# Altium schematic sheet Sheet.SchDoc
size A4
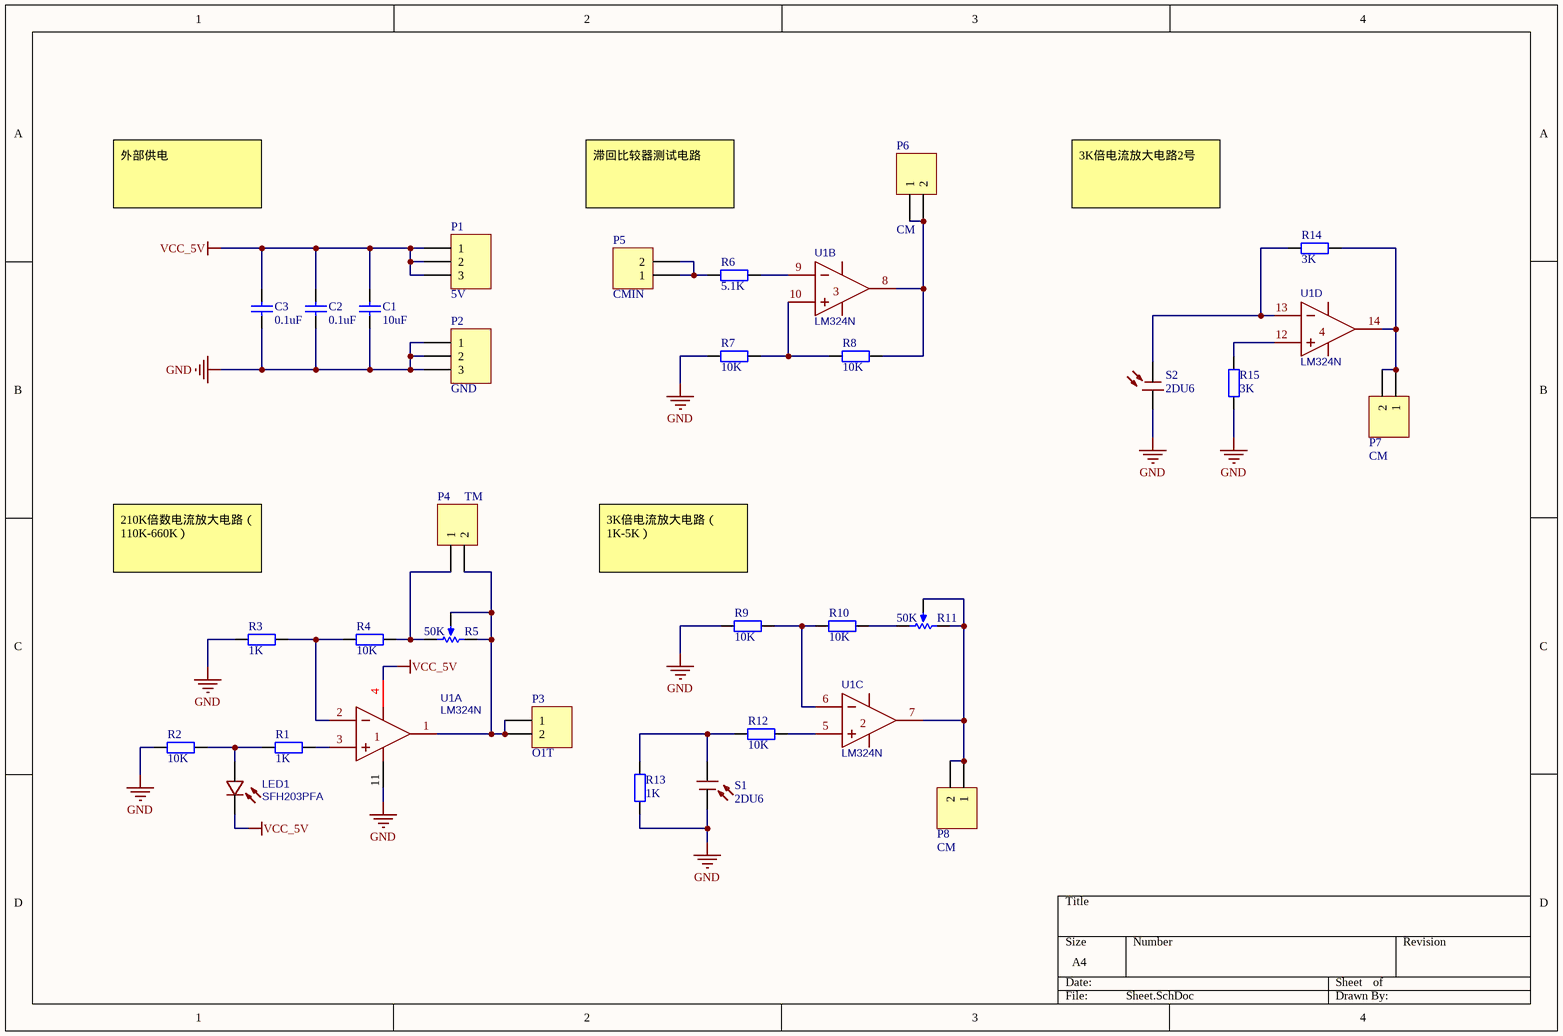
[diagram p0: Sheet.SchDoc]

## Parts
C1  value 10uF  [C1206]  (hidden comment: Cap Semi)
C2  value 0.1uF  [CAP-TH_L5.5-W3.0-P5.00-D0.6]  (hidden comment: Cap Semi)
C3  value 0.1uF  [CAP-TH_L5.5-W3.0-P5.00-D0.6]  (hidden comment: Cap Semi)
LED1  SFH203PFA  [LED-TH_BD5.9-P2.54-FD]
P1  5V  [HDR1X3]
P2  GND  [HDR1X3]
P3  O1T  [HDR1X2]
P4  TM  [HDR1X2]
P5  CMIN  [HDR1X2]
P6  CM  [HDR1X2]
P7  CM  [HDR1X2]
P8  CM  [HDR1X2]
R1  value 1K  [AXIAL-0.4]  (hidden comment: Res2)
R2  value 10K  [AXIAL-0.4]  (hidden comment: Res2)
R3  value 1K  [AXIAL-0.4]  (hidden comment: Res2)
R4  value 10K  [AXIAL-0.4]  (hidden comment: Res2)
R5  value 50K  [RES-ADJ-TH_3P-L10.0-W10.0-P2.50-L]  (hidden comment: RPot)
R6  value 5.1K  [AXIAL-0.4]  (hidden comment: Res2)
R7  value 10K  [AXIAL-0.4]  (hidden comment: Res2)
R8  value 10K  [AXIAL-0.4]  (hidden comment: Res2)
R9  value 10K  [AXIAL-0.4]  (hidden comment: Res2)
R10  value 10K  [AXIAL-0.4]  (hidden comment: Res2)
R11  value 50K  [RES-ADJ-TH_3P-L10.0-W10.0-P2.50-L]  (hidden comment: RPot)
R12  value 10K  [AXIAL-0.4]  (hidden comment: Res2)
R13  value 1K  [AXIAL-0.4]  (hidden comment: Res2)
R14  value 3K  [AXIAL-0.4]  (hidden comment: Res2)
R15  value 3K  [AXIAL-0.4]  (hidden comment: Res2)
S1  2DU6  [2DU6PERSONAL]
S2  2DU6  [2DU6PERSONAL]
U1  LM324N  [DIP-14_L19.4-W6.4-P2.54-LS7.6-BL]  (parts A,B,C,D of 4)

## Nets
GND: C1.1 C2.1 C3.1 P2.1 P2.2 P2.3 R2.1 R3.1 R7.1 R9.1 R13.1 R15.1 S1.2(E) S2.1(C) U1.11(GND)
VCC_5V: C1.2 C2.2 C3.2 LED1.2(E) P1.1 P1.2 P1.3 U1.4(VCC)
NetLED1_1: LED1.1(C) R1.2 R2.2
NetP3_1: P3.1 P3.2 P4.2 R5.1(TOP) R5.3(TAP) U1.1(OUT1)
NetP4_1: P4.1 R4.2 R5.2(BOT)
NetP5_1: P5.1 P5.2 R6.1
NetP6_1: P6.1 P6.2 R8.2 U1.8(OUT3)
NetP7_1: P7.1 P7.2 R14.2 U1.14(OUT4)
NetP8_1: P8.1 P8.2 R11.1(TOP) R11.3(TAP) U1.7(OUT2)
NetR1_1: R1.1 U1.3(IN1+)
NetR3_2: R3.2 R4.1 U1.2(IN1-)
NetR6_2: R6.2 U1.9(IN3-)
NetR7_2: R7.2 R8.1 U1.10(IN3+)
NetR9_2: R9.2 R10.1 U1.6(IN2-)
NetR10_2: R10.2 R11.2(BOT)
NetR12_1: R12.1 R13.2 S1.1(C)
NetR12_2: R12.2 U1.5(IN2+)
NetR14_1: R14.1 S2.2(E) U1.13(IN4-)
NetR15_2: R15.2 U1.12(IN4+)

## Notes on the sheet
- 外部供电
- 滞回比较器测试电路
- 3K倍电流放大电路2号
- 210K倍数电流放大电路（110K-660K）
- 3K倍电流放大电路（1K-5K）

## Library data of the parts
C1-C3 = Cap Semi: Capacitor (Semiconductor SIM Model); Published: 8-Jun-2000; LatestRevisionDate: 29-May-2009; LatestRevisionNote: IPC-7351 Footprint Added.; PackageReference: C1206; Publisher: Altium Limited; PackageDescription: Chip Capacitor
LED1 = SFH203PFA: BOM_Manufacturer: OSRAM Opto Semicon; Contributor: LCSC; BOM_Supplier: LCSC; BOM_Supplier Part: C554984; BOM_Manufacturer Part: SFH203PFA; BOM_JLCPCB Part Class: Extended Part; spicePre: L; spiceSymbolName: SFH203PFA
P1 P2 = Header 3: Header, 3-Pin; LatestRevisionDate: 17-Jul-2002; LatestRevisionNote: Re-released for DXP Platform.; Publisher: Altium Limited
P3-P8 = Header 2: Header, 2-Pin; LatestRevisionDate: 17-Jul-2002; LatestRevisionNote: Re-released for DXP Platform.; Publisher: Altium Limited
R1-R4 R6-R10 R12-R15 = Res2: Resistor; Published: 8-Jun-2000; LatestRevisionDate: 17-Jul-2002; LatestRevisionNote: Re-released for DXP Platform.; PackageReference: AXIAL-0.4; Publisher: Altium Limited; PackageDescription: Axial Device, Thru-Hole; 2 Leads; 0.4 in Pin Spacing
R5 R11 = RPot: Potentiometer; Sim Note: Enter the Resistance value and the set point into parameter fields.; Set Position: 0.5; Published: 8-Jun-2000; LatestRevisionDate: 17-Jul-2002; LatestRevisionNote: Re-released for DXP Platform.; PackageReference: VR5; Publisher: Altium Limited; PackageDescription: Variable Resistor, Thru-Hole; 3 Leads
U1 = LM324N: BOM_Manufacturer: HGSEMI; subpart_no: 1; BOM_Supplier: LCSC; BOM_Supplier Part: C725320; BOM_Manufacturer Part: LM324N; BOM_JLCPCB Part Class: Extended Part; spicePre: U; spiceSymbolName: LM324N_C725320